# EAGLE schematic PCR0_1 (EAGLE 7.0.0)
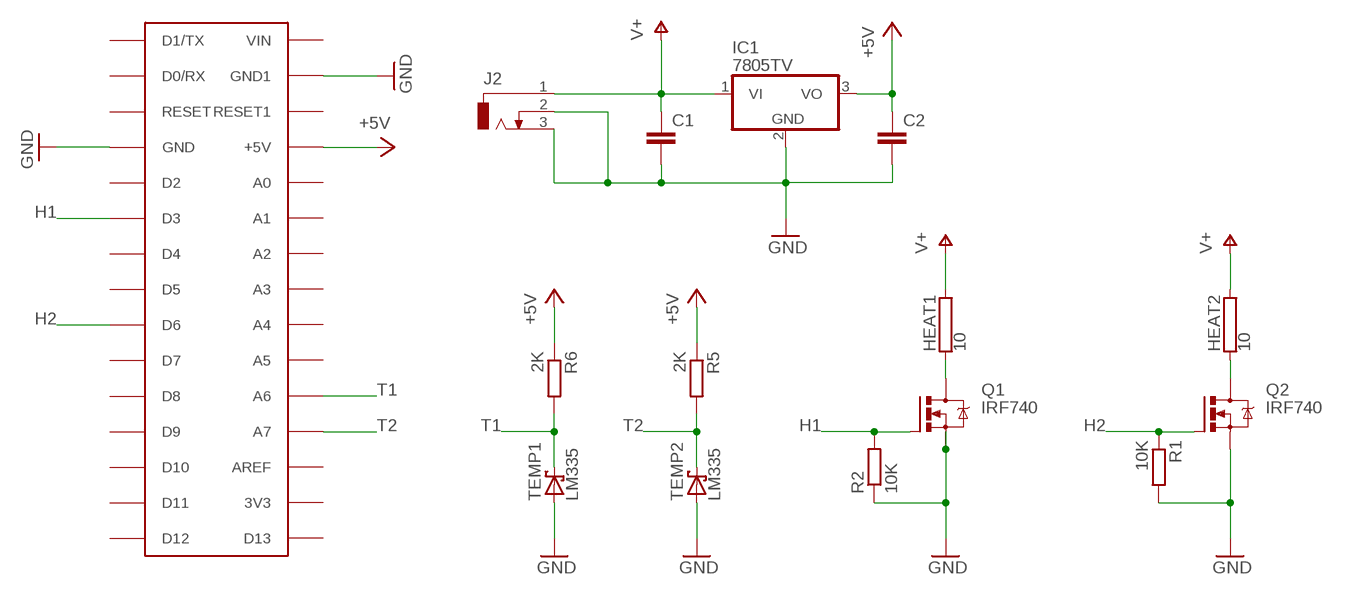
[diagram p0: schematic, sheet 1]

## Parts
C1  C-EU050-030X075  [C050-030X075]
C2  C-EU050-030X075  [C050-030X075]
HEAT1  10  RHPS932  [HPS932]
HEAT2  10  RHPS932  [HPS932]
IC1  7805TV  [TO220V]
J2  DCJ0303  [DCJ0303]
Q1  IRF740  [TO220BV]
Q2  IRF740  [TO220BV]
R1  10K  R-EU_0204/7  [0204/7]
R2  10K  R-EU_0204/7  [0204/7]
R5  2K  R-EU_0204/7  [0204/7]
R6  2K  R-EU_0204/7  [0204/7]
TEMP1  LM335  SCHOTTKY-DIODETO92H  [TO92H]
TEMP2  LM335  SCHOTTKY-DIODETO92H  [TO92H]
U$1  ARDUINONANO  [PDIP-32]

## Nets
+5V: C2.1 IC1.3(VO) R5.1 R6.1 U$1.+5V
GND: C1.2 C2.2 IC1.2(GND) J2.2 J2.3 Q1.S Q2.S R1.2 R2.1 TEMP1.1(A) TEMP2.1(A) U$1.GND U$1.GND1
H1: Q1.G R2.2 U$1.D3
H2: Q2.G R1.1 U$1.D6
N$6: HEAT1.1 Q1.D
N$9: HEAT2.1 Q2.D
T1: R6.2 TEMP1.2(C) U$1.A6
T2: R5.2 TEMP2.2(C) U$1.A7
V+: C1.1 HEAT1.2 HEAT2.2 IC1.1(VI) J2.1
Unconnected: U$1.3V3 U$1.A0 U$1.A1 U$1.A2 U$1.A3 U$1.A4 U$1.A5 U$1.AREF U$1.D0/RX U$1.D1/TX U$1.D2 U$1.D4 U$1.D5 U$1.D7 U$1.D8 U$1.D9 U$1.D10 U$1.D11 U$1.D12 U$1.D13 U$1.RESET U$1.RESET1 U$1.VIN

## Library data of the parts
C1 C2 = resistor:C-EU: CAPACITOR, European symbol
HEAT1 HEAT2 = resistor-power:R: Power Resitor; OC_FARNELL: unknown; OC_NEWARK: unknown
IC1 = linear:78*: Positive VOLTAGE REGULATOR Source: http://cache.national.com/ds/LM/LM78L05.pdf http://www.fairchildsemi.com/ds/LM/LM7805.pdf
J2 = con-jack:DCJ0303: DC POWER JACK Source: DCJ0303.pdf; OC_FARNELL: unknown; OC_NEWARK: unknown
Q1 Q2 = transistor-power:IRF740: N-CHANNEL MOS FET
R1 R2 R5 R6 = resistor:R-EU_: RESISTOR, European symbol
TEMP1 TEMP2 = diode:SCHOTTKY-DIODE: Schottky Diode
U$1 = jet-lib:ARDUINONANO

## Net classes
1 power: width 0.051 mm